# Altium project ATRACK_KP_V1.PrjPcb
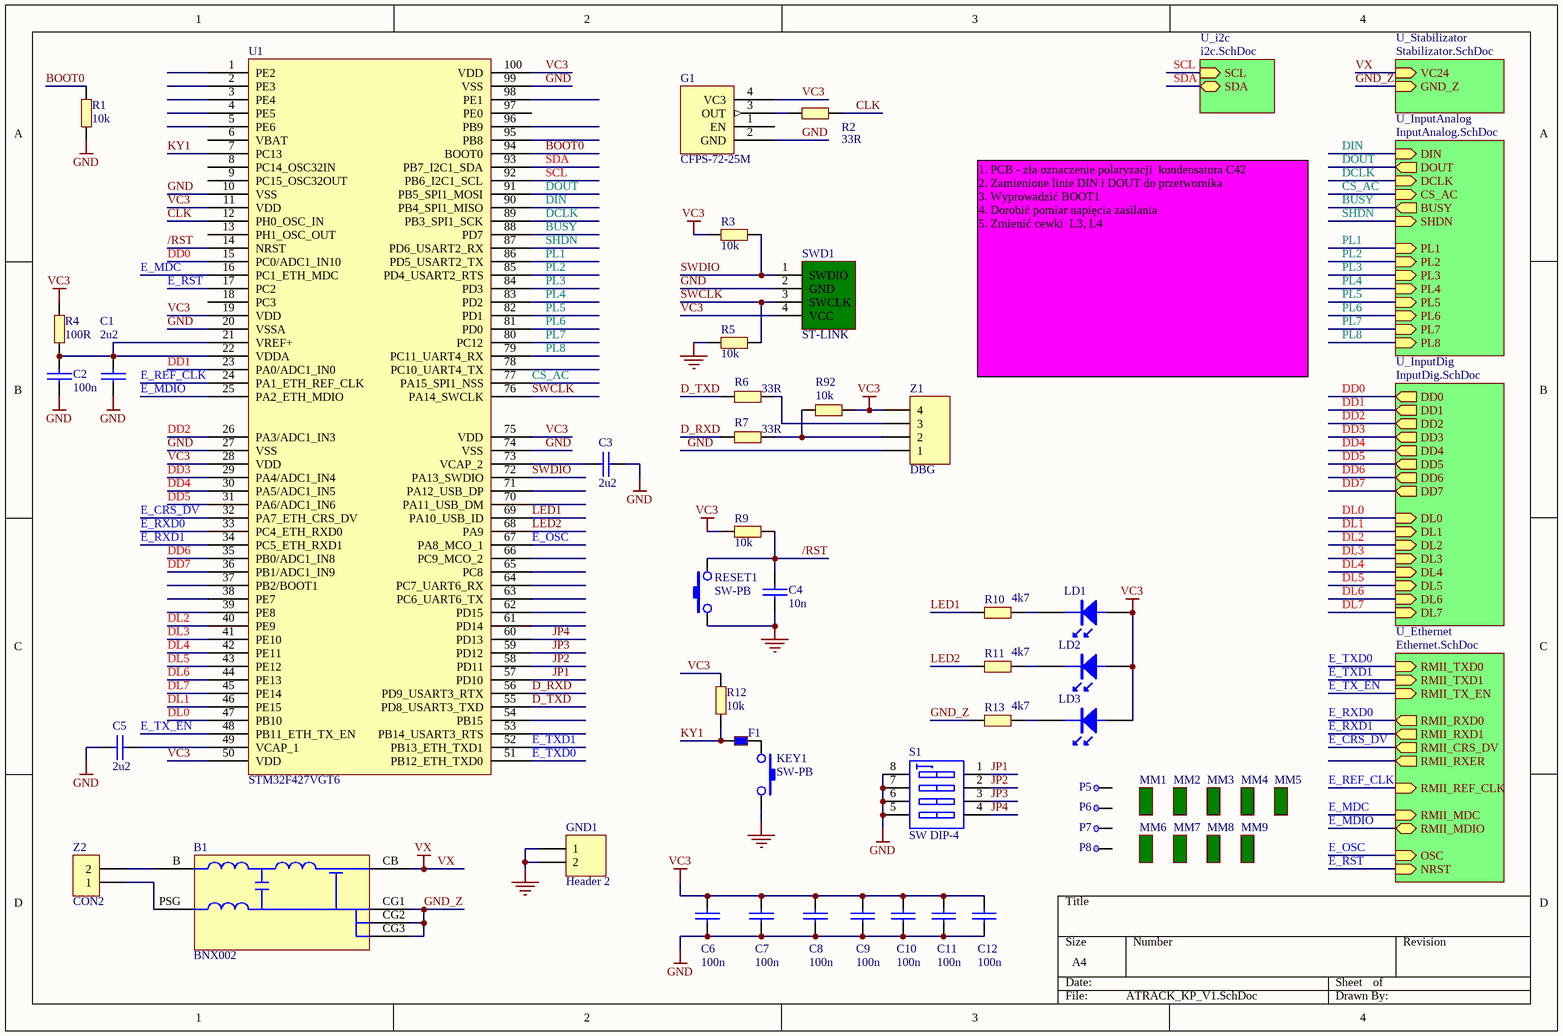
[diagram p0: ATRACK_KP_V1.SchDoc]
6 sheets, 246 parts. Net scope: hierarchical (ports join the sheet entries above them; power ports are global).
Board file: ATRACK_KP_V1.PcbDoc
Sheets:
  ATRACK_KP_V1.SchDoc
    U_Stabilizator = Stabilizator.SchDoc
    U_Ethernet = Ethernet.SchDoc
    U_InputDig = InputDig.SchDoc
    U_InputAnalog = InputAnalog.SchDoc
    U_i2c = i2c.SchDoc

## Sheet ATRACK_KP_V1.SchDoc
size A4

### Parts
B1  BNX002  [BNX002]
C1  2u2  [0603C]
C2  100n  [0603C]
C3  2u2  [0603C]
C4  10n  [0603C]
C5  2u2  [0603C]
C6  100n  [0603C]
C7  100n  [0603C]
C8  100n  [0603C]
C9  100n  [0603C]
C10  100n  [0603C]
C11  100n  [0603C]
C12  100n  [0603C]
F1  BLM18BB141SN1D  [0603L]  (value not drawn)
G1  CFPS-72-25M  [GEN_SMD1_1]
GND1  Header 2  [HDR1X2]
KEY1  SW-PB  [DTSM31N_2]
LD1  (no value)  [0603DG]
LD2  (no value)  [0603DR]
LD3  (no value)  [0603DG]
MM1  (no value)  [REF_CIR]
MM2  (no value)  [REF_CIR]
MM3  (no value)  [REF_SQR]
MM4  (no value)  [REF_SQR]
MM5  (no value)  [PB_FREE_GRAF]
MM6  (no value)  [REF_CIR]
MM7  (no value)  [REF_CIR]
MM8  (no value)  [REF_SQR]
MM9  (no value)  [REF_SQR]
P5  PP  [PP_SR]  (value not drawn)
P6  PP  [PP_SR]  (value not drawn)
P7  PP  [PP_SR]  (value not drawn)
P8  PP  [PP_SR]  (value not drawn)
R1  10k  [0603R]
R2  33R  [0603R]
R3  10k  [0603R]
R4  100R  [0603R]
R5  10k  [0603R]
R6  33R  [0603R]
R7  33R  [0603R]
R9  10k  [0603R]
R10  4k7  [0603R]
R11  4k7  [0603R]
R12  10k  [0603R]
R13  4k7  [0603R]
R92  10k  [0603R]
RESET1  SW-PB  [DTSM31N_2]
S1  SW DIP-4  [DIP8-SW]
SWD1  ST-LINK  [PIN4]
U1  STM32F427VGT6  [VQ100_2]
Z1  DBG  [PIN4]
Z2  CON2  [ARC-2-5.08-A1]

### Sub-sheets
U_Ethernet = Ethernet.SchDoc: RMII_TXD0 (in), RMII_TX_EN (in), RMII_RXD0 (out), RMII_REF_CLK (in), RMII_CRS_DV (out), RMII_MDC (in), RMII_MDIO (bidir), NRST (in), RMII_TXD1 (in), RMII_RXD1 (out), RMII_RXER (out), OSC (in)
U_i2c = i2c.SchDoc: SCL (in), SDA (bidir)
U_InputAnalog = InputAnalog.SchDoc: PL1 (in), PL2 (in), PL3 (in), PL4 (in), PL5 (in), PL6 (in), PL7 (in), DIN (in), DOUT (out), CS_AC (in), DCLK (in), BUSY (out), SHDN (in), PL8 (in)
U_InputDig = InputDig.SchDoc: DL0 (in), DL1 (in), DL2 (in), DL3 (in), DL4 (in), DL5 (in), DL6 (in), DL7 (in), DD0 (out), DD1 (out), DD2 (out), DD3 (out), DD4 (out), DD5 (out), DD6 (out), DD7 (out)
U_Stabilizator = Stabilizator.SchDoc: VC24 (in), GND_Z (in)

### Nets
GND: C1.2 C2.2 C3.1 C4.2 C5.1 C6.2 C7.2 C8.2 C9.2 C10.2 C11.2 C12.2 G1.2(GND) GND1.1 GND1.2 KEY1.2 R1.2 R5.1 RESET1.1 S1.5(B4) S1.6(B3) S1.7(B2) S1.8(B1) SWD1.2(GND) U1.10(VSS) U1.20(VSSA) U1.27(VSS) U1.74(VSS) U1.99(VSS) Z1.1
VC3: C6.1 C7.1 C8.1 C9.1 C10.1 C11.1 C12.1 G1.4(VC3) LD1.A LD2.A LD3.A R3.1 R4.2 R9.1 R12.2 R92.2 SWD1.4(VCC) U1.11(VDD) U1.19(VDD) U1.28(VDD) U1.50(VDD) U1.75(VDD) U1.100(VDD) Z1.4
VX: B1.CB ; sheet U_Stabilizator/VC24
/RST: C4.1 R9.2 RESET1.2 U1.14(NRST)
BOOT0: R1.1 U1.94(BOOT0)
BUSY: U1.88(PD7) ; sheet U_InputAnalog/BUSY
CLK: R2.2 U1.12(PH0_OSC_IN)
CS_AC: U1.77(PA15_SPI1_NSS) ; sheet U_InputAnalog/CS_AC  [project net /CS_AC]
D_RXD: R7.2 U1.56(PD9_USART3_RTX)
D_TXD: R6.2 U1.55(PD8_USART3_TXD)
DCLK: U1.89(PB3_SPI1_SCK) ; sheet U_InputAnalog/DCLK
DD0: U1.15(PC0/ADC1_IN10) ; sheet U_InputDig/DD0
DD1: U1.23(PA0/ADC1_IN0) ; sheet U_InputDig/DD1
DD2: U1.26(PA3/ADC1_IN3) ; sheet U_InputDig/DD2
DD3: U1.29(PA4/ADC1_IN4) ; sheet U_InputDig/DD3
DD4: U1.30(PA5/ADC1_IN5) ; sheet U_InputDig/DD4
DD5: U1.31(PA6/ADC1_IN6) ; sheet U_InputDig/DD5
DD6: U1.35(PB0/ADC1_IN8) ; sheet U_InputDig/DD6
DD7: U1.36(PB1/ADC1_IN9) ; sheet U_InputDig/DD7
DIN: U1.90(PB4_SPI1_MISO) ; sheet U_InputAnalog/DIN
DL0: U1.47(PB10) ; sheet U_InputDig/DL0
DL1: U1.46(PE15) ; sheet U_InputDig/DL1
DL2: U1.40(PE9) ; sheet U_InputDig/DL2
DL3: U1.41(PE10) ; sheet U_InputDig/DL3
DL4: U1.42(PE11) ; sheet U_InputDig/DL4
DL5: U1.43(PE12) ; sheet U_InputDig/DL5
DL6: U1.44(PE13) ; sheet U_InputDig/DL6
DL7: U1.45(PE14) ; sheet U_InputDig/DL7
DOUT: U1.91(PB5_SPI1_MOSI) ; sheet U_InputAnalog/DOUT
E_CRS_DV: U1.32(PA7_ETH_CRS_DV) ; sheet U_Ethernet/RMII_CRS_DV
E_MDC: U1.16(PC1_ETH_MDC) ; sheet U_Ethernet/RMII_MDC
E_MDIO: U1.25(PA2_ETH_MDIO) ; sheet U_Ethernet/RMII_MDIO
E_OSC: U1.67(PA8_MCO_1) ; sheet U_Ethernet/OSC
E_REF_CLK: U1.24(PA1_ETH_REF_CLK) ; sheet U_Ethernet/RMII_REF_CLK
E_RST: U1.17(PC2) ; sheet U_Ethernet/NRST
E_RXD0: U1.33(PC4_ETH_RXD0) ; sheet U_Ethernet/RMII_RXD0
E_RXD1: U1.34(PC5_ETH_RXD1) ; sheet U_Ethernet/RMII_RXD1
E_TX_EN: U1.48(PB11_ETH_TX_EN) ; sheet U_Ethernet/RMII_TX_EN
E_TXD0: U1.51(PB12_ETH_TXD0) ; sheet U_Ethernet/RMII_TXD0
E_TXD1: U1.52(PB13_ETH_TXD1) ; sheet U_Ethernet/RMII_TXD1
GND_Z: B1.CG1 B1.CG2 B1.CG3 R13.2 ; sheet U_Stabilizator/GND_Z
JP1: S1.1(A1) U1.57(PD10)
JP2: S1.2(A2) U1.58(PD11)
JP3: S1.3(A3) U1.59(PD12)
JP4: S1.4(A4) U1.60(PD13)
KY1: F1.2 R12.1 U1.7(PC13)
LED1: R10.2 U1.69(PA10_USB_ID)
LED2: R11.2 U1.68(PA9)
PL1: U1.86(PD5_USART2_TX) ; sheet U_InputAnalog/PL1
PL2: U1.85(PD4_USART2_RTS) ; sheet U_InputAnalog/PL2
PL3: U1.84(PD3) ; sheet U_InputAnalog/PL3
PL4: U1.83(PD2) ; sheet U_InputAnalog/PL4
PL5: U1.82(PD1) ; sheet U_InputAnalog/PL5
PL6: U1.81(PD0) ; sheet U_InputAnalog/PL6
PL7: U1.80(PC12) ; sheet U_InputAnalog/PL7
PL8: U1.79(PC11_UART4_RX) ; sheet U_InputAnalog/PL8
SCL: U1.92(PB6_I2C1_SCL) ; sheet U_i2c/SCL
SDA: U1.93(PB7_I2C1_SDA) ; sheet U_i2c/SDA
SHDN: U1.87(PD6_USART2_RX) ; sheet U_InputAnalog/SHDN
SWCLK: R5.2 SWD1.3(SWCLK) U1.76(PA14_SWCLK)
SWDIO: R3.2 SWD1.1(SWDIO) U1.72(PA13_SWDIO)
NetB1_B: B1.B Z2.2
NetB1_PSG: B1.PSG Z2.1
NetC1_1: C1.1 C2.1 R4.1 U1.21(VREF+) U1.22(VDDA)
NetC3_2: C3.2 U1.73(VCAP_2)
NetC5_2: C5.2 U1.49(VCAP_1)
NetF1_1: F1.1 KEY1.1
NetG1_3: G1.3(OUT) R2.1
NetLD1_K: LD1.K R10.1
NetLD2_K: LD2.K R11.1
NetLD3_K: LD3.K R13.1
NetR6_1: R6.1 Z1.3
NetR7_1: R7.1 R92.1 Z1.2

Not connected (* = marked no-connect by the designer): G1 1(EN); P5 1; P6 1; P7 1; P8 1; U1 1(PE2) 2(PE3) 3(PE4) 4(PE5) 5(PE6) 6(VBAT) 8(PC14_OSC32IN) 9(PC15_OSC32OUT) 13(PH1_OSC_OUT) 18(PC3) 37(PB2/BOOT1) 38(PE7) 39(PE8) 53(PB14_USART3_RTS) 54(PB15) 61(PD14) 62(PD15) 63(PC6_UART6_TX) 64(PC7_UART6_RX) 65(PC8) 66(PC9_MCO_2) 70(PA11_USB_DM) 71(PA12_USB_DP) 78(PC10_UART4_TX) 95(PB8) 96(PB9) 97(PE0) 98(PE1)

### Notes on the sheet
- 1. PCB - zła oznaczenie polaryzacji  kondensatora C42
  2. Zamienione linie DIN i DOUT do przetwornika
  3. Wyprowadzić BOOT1
  4. Dorobić pomiar napięcia zasilania
  5. Zmienić cewki  L3, L4

### Library data of the parts
C1-C12 = CAP: Capacitor
F1 = KORALIK: Koralik ferrytowy
G1 = GENER_SMD
GND1 = Header 2: Header, 2-Pin; LatestRevisionDate: 17-Jul-2002; LatestRevisionNote: Re-released for DXP Platform.; Publisher: Altium Limited
LD1-LD3 = LED
MM1-MM9 = MECH
R1-R7 R9-R13 R92 = RES3
S1 = SW DIP-4: DIP Switch
SWD1 = SW_CON: Header, 4-Pin; LatestRevisionDate: 17-Jul-2002; LatestRevisionNote: Re-released for DXP Platform.; Publisher: Altium Limited
U1 = STM32F427_LQFP100
Z1 = Header 4: Header, 4-Pin; LatestRevisionDate: 17-Jul-2002; LatestRevisionNote: Re-released for DXP Platform.; Publisher: Altium Limited
Z2 = CON2: Connector

## Sheet Stabilizator.SchDoc
size A4
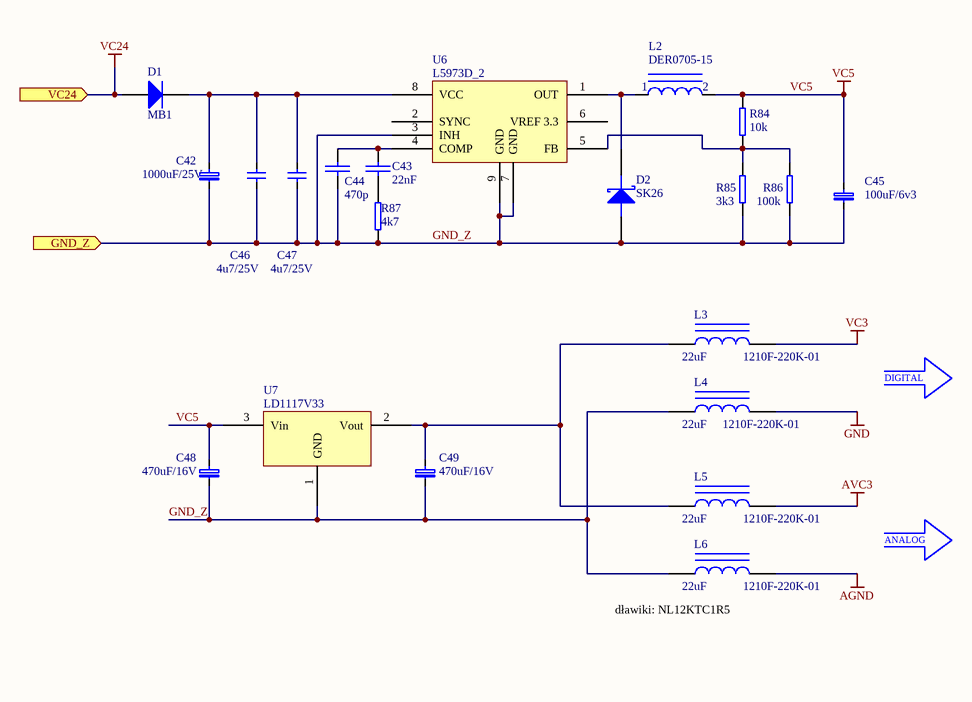
[diagram p1: Stabilizator.SchDoc]

### Parts
C42  1000uF/25V  [RB-.2/.4]
C43  22nF  [0603C]
C44  470p  [0603C]
C45  100uF/6v3  [CAP_C]
C46  4u7/25V  [1206]
C47  4u7/25V  [1206]
C48  470uF/16V  [CAP_D]
C49  470uF/16V  [CAP_D]
D1  MB1  [RD5]
D2  SK26  [RD5]
L2  DER0705-15  [DER0705_1]
L3  1210F-220K-01  value 22uF  [IND_1812]
L4  1210F-220K-01  value 22uF  [IND_1812]
L5  1210F-220K-01  value 22uF  [IND_1812]
L6  1210F-220K-01  value 22uF  [IND_1812]
R84  10k  [0603R]
R85  3k3  [0603R]
R86  100k  [0603R]
R87  4k7  [0603R]
U6  L5973D_2  [SO8_M]
U7  LD1117V33  [DPAK]

### Ports
GND_Z (in), VC24 (in)

### Nets
AGND: L6.2
AVC3: L5.2
GND: L4.2
VC3: L3.2
VC5: C45.2 C48.2 L2.2 R84.1 U7.3(Vin)
VC24: D1.A ; port VC24  [project net VX]
GND_Z: C42.1 C44.2 C45.1 C46.1 C47.1 C48.1 C49.1 D2.A L4.1 L6.1 R85.2 R86.2 R87.2 U6.3(INH) U6.7(GND) U6.9(GND) U7.1(GND) ; port GND_Z
NetC42_2: C42.2 C46.2 C47.2 D1.K U6.8(VCC)
NetC43_1: C43.1 R87.1
NetC43_2: C43.2 C44.1 U6.4(COMP)
NetC49_2: C49.2 L3.1 L5.1 U7.2(Vout)
NetD2_K: D2.K L2.1 U6.1(OUT)
NetR84_2: R84.2 R85.1 R86.1 U6.5(FB)

Not connected (* = marked no-connect by the designer): U6 2(SYNC) 6(VREF_3.3)

### Notes on the sheet
- DIGITAL
- ANALOG
- (near L6) dławiki: NL12KTC1R5

### Library data of the parts
C42 C45 C48 C49 = CAP_TANTAL_SMD: KONDENSATOR ELEKTROLITYCZNY TANTALOWY SMD
C43 C44 = CAP: Capacitor
C46 C47 = CAP
D1 = Diode: Default Diode; Published: 8-Jun-2000; LatestRevisionDate: 17-Jul-2002; LatestRevisionNote: Re-released for DXP Platform.; PackageVersion: Sep-1996; PackageReference: SMC; Publisher: Altium Limited; PackageDescription: DO-214-AB/SMC; 2 C-Bend Leads; Body 7.9 x 5.9 mm, inc. leads (LxW); Code_JEDEC: DO-214-AB
D2 = DIODE SCHOTTKY: Schottky Diode
L2 = CEWKA_1
L3-L6 = Inductor Iron: Magnetic-Core Inductor; Dostawca.Symbol: DL1210-0.47; Dostawca: TME; Published: 24-Mar-1999; LatestRevisionDate: 17-Jul-2002; LatestRevisionNote: Re-released for DXP Platform.; PackageReference: AXIAL-0.9; Publisher: Altium Limited
R84-R87 = RES3

## Sheet Ethernet.SchDoc
size A4
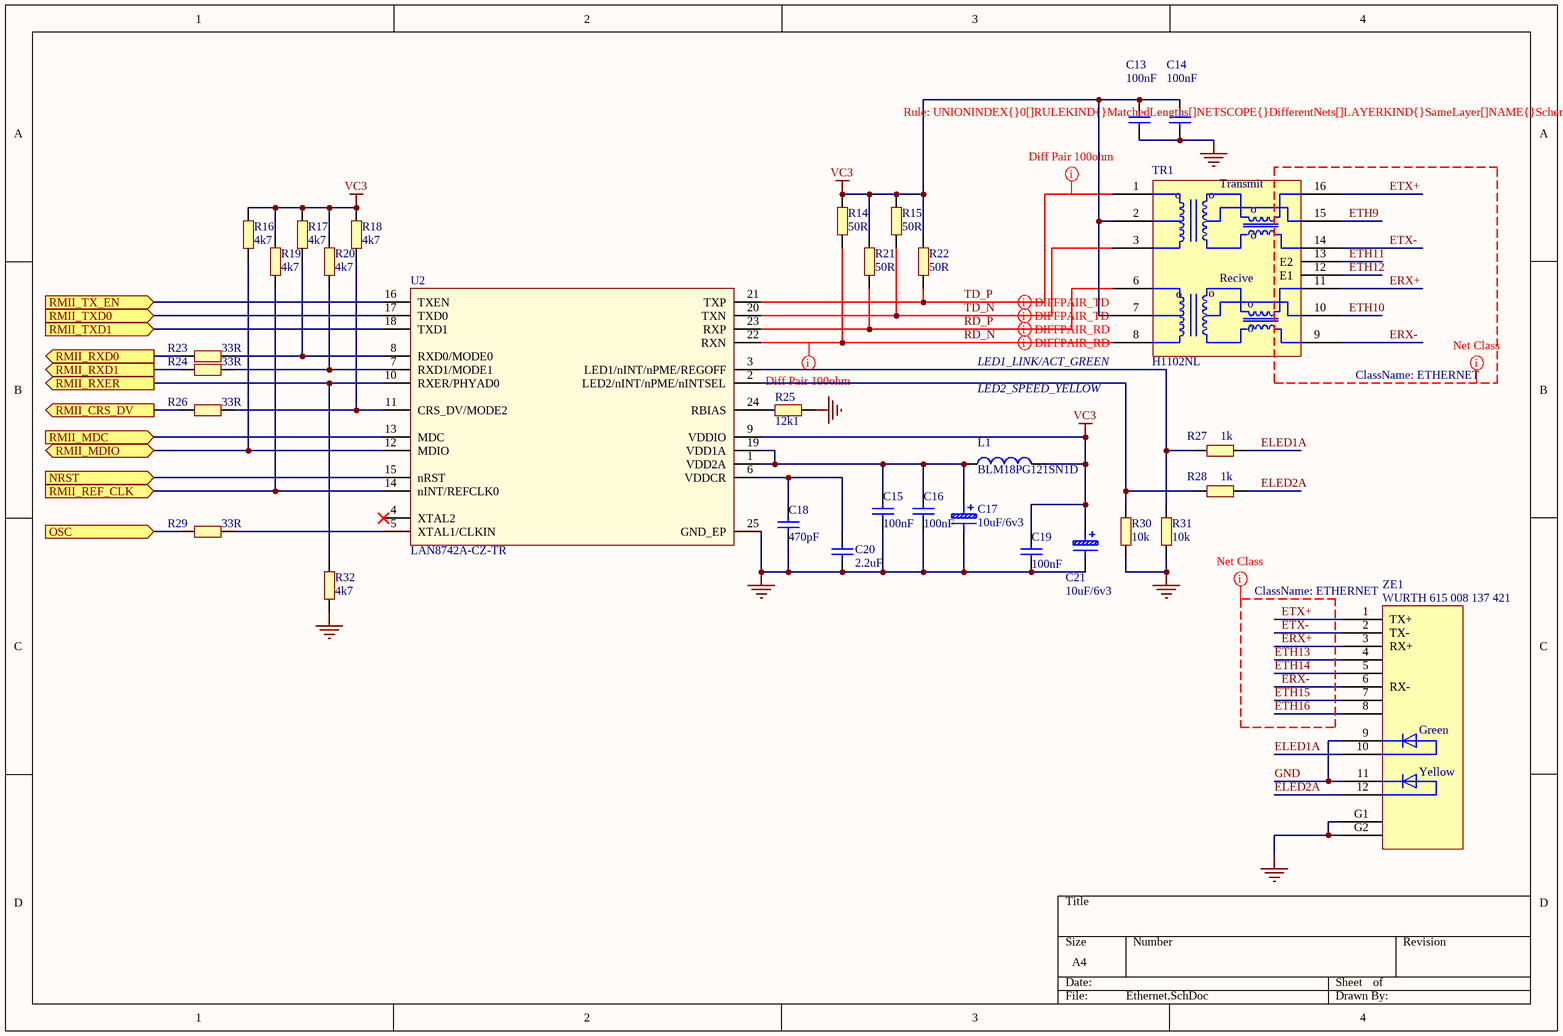
[diagram p2: Ethernet.SchDoc]

### Parts
C13  100nF  [0603C]
C14  100nF  [0603C]
C15  100nF  [0603C]
C16  100nF  [0603C]
C17  10uF/6v3  [CAP_A]
C18  470pF  [0603C]
C19  100nF  [0603C]
C20  2.2uF  [0603C]
C21  10uF/6v3  [CAP_A]
L1  BLM18PG121SN1D  [0603L]
R14  50R  [0603R]
R15  50R  [0603R]
R16  4k7  [0603R]
R17  4k7  [0603R]
R18  4k7  [0603R]
R19  4k7  [0603R]
R20  4k7  [0603R]
R21  50R  [0603R]
R22  50R  [0603R]
R23  33R  [0603R]
R24  33R  [0603R]
R25  12k1  [0603R]
R26  33R  [0603R]
R27  1k  [0603R]
R28  1k  [0603R]
R29  33R  [0603R]
R30  10k  [0603R]
R31  10k  [0603R]
R32  4k7  [0603R]
TR1  H1102NL  [H1102]
U2  LAN8742A-CZ-TR  [QFN24_LAN]
ZE1  WURTH 615 008 137 421  [RJHSE-3381]

### Ports
NRST (in), OSC (in), RMII_CRS_DV (out), RMII_MDC (in), RMII_MDIO (bidir), RMII_REF_CLK (in), RMII_RXD0 (out), RMII_RXD1 (out), RMII_RXER (out), RMII_TX_EN (in), RMII_TXD0 (in), RMII_TXD1 (in)

### Nets
GND: C13.1 C14.1 C15.1 C16.1 C17.1 C18.1 C19.1 C20.1 C21.1 R25.1 R30.1 R31.1 R32.1 U2.25(GND_EP) ZE1.9 ZE1.11 ZE1.G1 ZE1.G2
VC3: C13.2 C14.2 C19.2 C21.2 L1.2 R14.2 R15.2 R16.2 R17.1 R18.1 R19.2 R20.1 R21.2 R22.2 TR1.2(TI2) TR1.7(RI2) U2.9(VDDIO)
E_CRS_DV: R26.1 ; port RMII_CRS_DV
E_MDC: U2.13(MDC) ; port RMII_MDC
E_MDIO: R16.1 U2.12(MDIO) ; port RMII_MDIO
E_OSC: R29.1 ; port OSC
E_REF_CLK: R19.1 U2.14(nINT/REFCLK0) ; port RMII_REF_CLK
E_RST: U2.15(nRST) ; port NRST
E_RXD0: R23.1 ; port RMII_RXD0
E_RXD1: R24.1 ; port RMII_RXD1
E_TX_EN: U2.16(TXEN) ; port RMII_TX_EN
E_TXD0: U2.17(TXD0) ; port RMII_TXD0
E_TXD1: U2.18(TXD1) ; port RMII_TXD1
ELED1A: R27.1 ZE1.10
ELED2A: R28.1 ZE1.12
ERX+: TR1.11(RO1) ZE1.3(RX+)
ERX-: TR1.9(RO2) ZE1.6(RX-)
ETH9: TR1.15
ETH10: TR1.10
ETH11: TR1.13(E2)
ETH12: TR1.12(E1)
ETH13: ZE1.4
ETH14: ZE1.5
ETH15: ZE1.7
ETH16: ZE1.8
ETX+: TR1.16(TO1) ZE1.1(TX+)
ETX-: TR1.14(TO2) ZE1.2(TX-)
RD_N: R14.1 TR1.8(RI3) U2.22(RXN)
RD_P: R21.1 TR1.6(RI1) U2.23(RXP)
TD_N: R15.1 TR1.3(TI3) U2.20(TXN)
TD_P: R22.1 TR1.1(TI1) U2.21(TXP)
NetC15_2: C15.2 C16.2 C17.2 L1.1 U2.1(VDD2A) U2.19(VDD1A)
NetC18_2: C18.2 C20.2 U2.6(VDDCR)
NetR17_2: R17.2 R23.2 U2.8(RXD0/MODE0)
NetR18_2: R18.2 R26.2 U2.11(CRS_DV/MODE2)
NetR20_2: R20.2 R24.2 U2.7(RXD1/MODE1)
NetR25_2: R25.2 U2.24(RBIAS)
NetR27_2: R27.2 R31.2 U2.3(LED1/nINT/nPME/REGOFF)
NetR28_2: R28.2 R30.2 U2.2(LED2/nINT/nPME/nINTSEL)
NetR29_2: R29.2 U2.5(XTAL1/CLKIN)
NetR32_2: R32.2 U2.10(RXER/PHYAD0) ; port RMII_RXER

Not connected (* = marked no-connect by the designer): U2 4(XTAL2)*

### Layout directives
differential pair: RD_N, RD_P, TD_N, TD_P
rule Matched Net Lengths [Tolerance = 300mil]: RD_N, TD_P
net class ETHERNET: ERX+, ERX-, ETH9, ETH10, ETH11, ETH12, ETH13, ETH14, ETH15, ETH16, ETX+, ETX-

### Notes on the sheet
- LED1_LINK/ACT_GREEN
- LED2_SPEED_YELLOW
- (in symbol H1102NL) Transmit; o; Recive
- (in symbol RJ45GELED) Green; Yellow

### Library data of the parts
C13-C16 C19 = Cap_100nF_X7R_10%_0402: Capacitor,100nF,16V,X7R,10%,0402,YAGEO; Manuf_Part_1: CC0402KRX7R7BB104; Revision: July-2002: Re-released for DXP Platform.; Value: 100nF; Order: CC0402KRX7R7BB104; Manuf_1: YAGEO
C17 C21 = CapTantal
C18 = Cap_470pF_X7R_10%_0402: Capacitor,470pF,16V,X7R,10%,0402,YAGEO; Manuf_Part_1: 0402YC471KAT4A; Revision: July-2002: Re-released for DXP Platform.; Value: 470pF; Order: 0402YC471KAT4A; Manuf_1: YAGEO; ECCN_US/EU: n/a
C20 = Cap_1uF_X5R_10%_0603: Capacitor,1uF,16V,X5R,10%,0603,YAGEO; Manuf_Part_1: CC0603KRX5R7BB105; Revision: July-2002: Re-released for DXP Platform.; Value: 1uF; Order: CC0603KRX5R7BB105; Manuf_1: YAGEO; ECCN_US/EU: n/a
L1 = BEAD_120R_2A_0603: Bead,120R,2A,0603,BLM18PG121SN1D,MURATA; Manuf_Part_3: FCM1608KF-601T03; Manuf_2: TDK; Manuf_Part_2: MPZ1608S300A; Manuf_3: Tai-tech; Value: 100uH; Description_3: Bead,600R,350mA,0603,FCM1608KF-601T03,Tai-tech; Description_2: Bead,30R,5A,0603,MPZ1608S300A,TDK; Revision: July-2002: Re-released for DXP Platform.; ECCN_US/EU: n/a; Manuf_Part_1: BLM18PG121SN1D; Manuf_1: MURATA
R14-R32 = RES3
TR1 = H1102NL: Dostawca.Symbol: 749010310; Dostawca: WURTH
U2 = LAN8742A-CZ-TR: LAN8742A-CZ-TR - Small Footprint RMII 10/100 Ethernet, Transceiver with HP Auto-MDIX and flexPWR Technology SQFN-24; Manuf_1: MICROCHIP; Dostawca.Symbol: 579-LAN8742A-CZ; Dostawca: Mouser; Order: LAN8742A-CZ-TR; Manuf_Part_1: LAN8742A-CZ-TR; Distrib: MICROCHIP
ZE1 = RJ45GELED

## Sheet InputDig.SchDoc
size A4 portrait
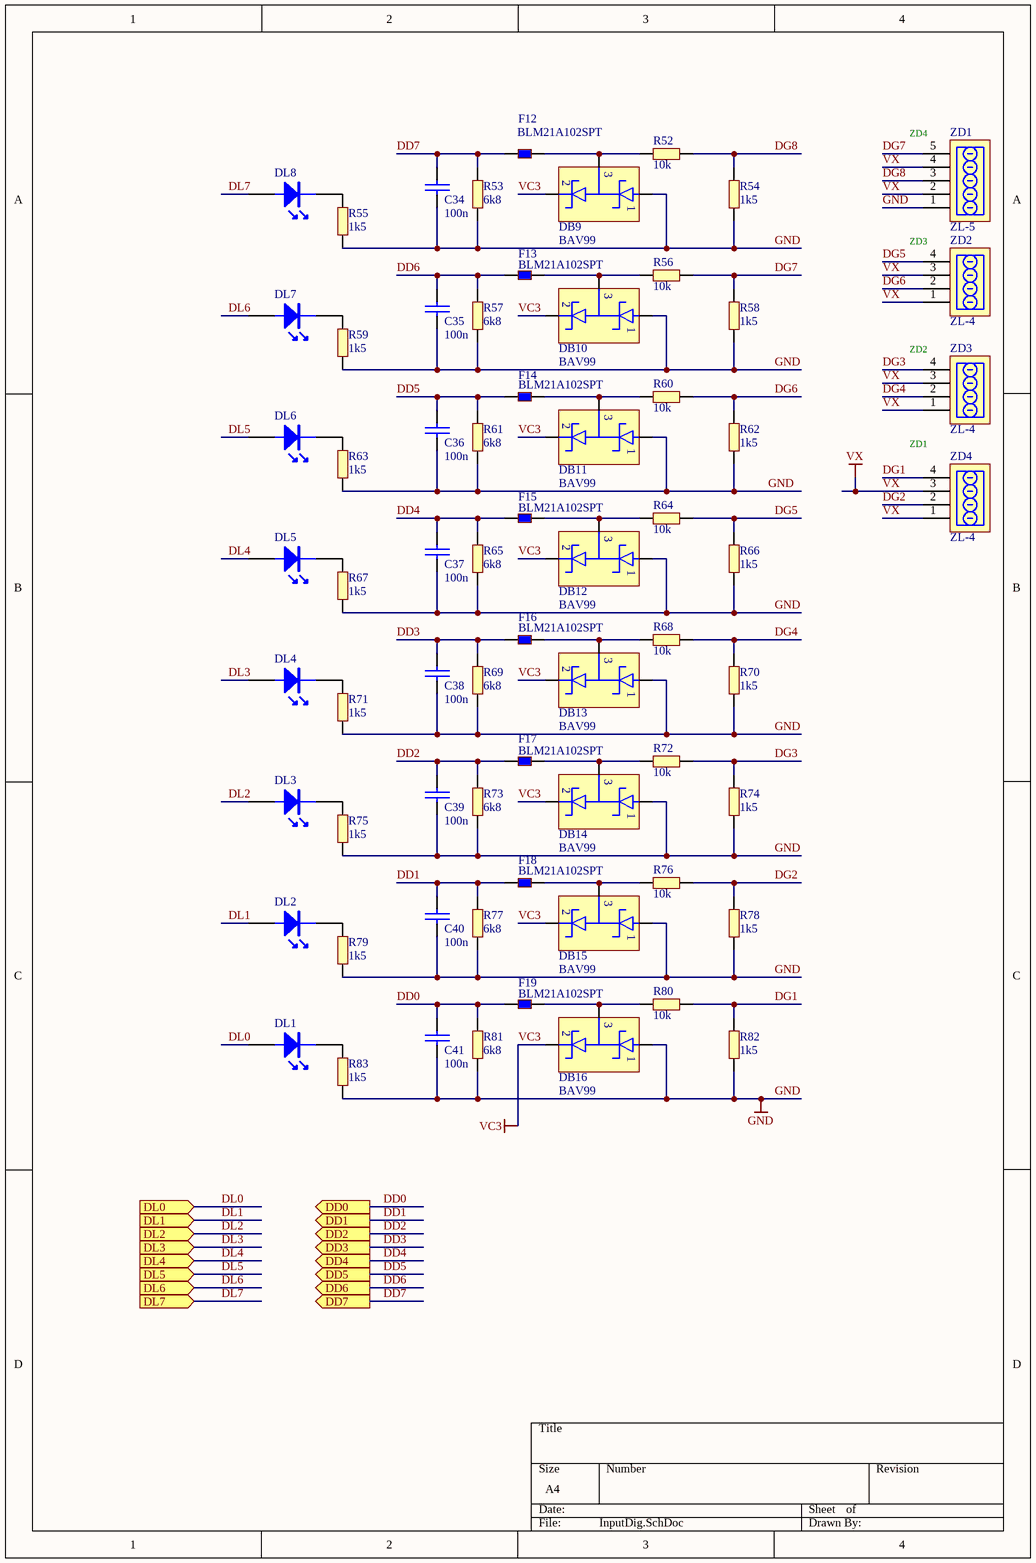
[diagram p3: InputDig.SchDoc]

### Parts
C34  100n  [0603C]
C35  100n  [0603C]
C36  100n  [0603C]
C37  100n  [0603C]
C38  100n  [0603C]
C39  100n  [0603C]
C40  100n  [0603C]
C41  100n  [0603C]
DB9  BAV99  [SOT-23]
DB10  BAV99  [SOT-23]
DB11  BAV99  [SOT-23]
DB12  BAV99  [SOT-23]
DB13  BAV99  [SOT-23]
DB14  BAV99  [SOT-23]
DB15  BAV99  [SOT-23]
DB16  BAV99  [SOT-23]
DL1  (no value)  [0603DR]
DL2  (no value)  [0603DR]
DL3  (no value)  [0603DR]
DL4  (no value)  [0603DR]
DL5  (no value)  [0603DR]
DL6  (no value)  [0603DR]
DL7  (no value)  [0603DR]
DL8  (no value)  [0603DR]
F12  BLM21A102SPT  [0603L]
F13  BLM21A102SPT  [0603L]
F14  BLM21A102SPT  [0603L]
F15  BLM21A102SPT  [0603L]
F16  BLM21A102SPT  [0603L]
F17  BLM21A102SPT  [0603L]
F18  BLM21A102SPT  [0603L]
F19  BLM21A102SPT  [0603L]
R52  10k  [0603R]
R53  6k8  [0603R]
R54  1k5  [0805R]
R55  1k5  [0603R]
R56  10k  [0603R]
R57  6k8  [0603R]
R58  1k5  [0805R]
R59  1k5  [0603R]
R60  10k  [0603R]
R61  6k8  [0603R]
R62  1k5  [0805R]
R63  1k5  [0603R]
R64  10k  [0603R]
R65  6k8  [0603R]
R66  1k5  [0805R]
R67  1k5  [0603R]
R68  10k  [0603R]
R69  6k8  [0603R]
R70  1k5  [0805R]
R71  1k5  [0603R]
R72  10k  [0603R]
R73  6k8  [0603R]
R74  1k5  [0805R]
R75  1k5  [0603R]
R76  10k  [0603R]
R77  6k8  [0603R]
R78  1k5  [0805R]
R79  1k5  [0603R]
R80  10k  [0603R]
R81  6k8  [0603R]
R82  1k5  [0805R]
R83  1k5  [0603R]
ZD1  ZL-5  [ARC-5-3.5-TYCO-2]
ZD2  ZL-4  [ARC-4-3.5-TYCO-2]
ZD3  ZL-4  [ARC-4-3.5-TYCO-2]
ZD4  ZL-4  [ARC-4-3.5-TYCO-2]

### Ports
DD0 (out), DD1 (out), DD2 (out), DD3 (out), DD4 (out), DD5 (out), DD6 (out), DD7 (out), DL0 (in), DL1 (in), DL2 (in), DL3 (in), DL4 (in), DL5 (in), DL6 (in), DL7 (in)

### Nets
GND: C34.2 C35.2 C36.2 C37.2 C38.2 C39.2 C40.2 C41.2 DB9.1 DB10.1 DB11.1 DB12.1 DB13.1 DB14.1 DB15.1 DB16.1 R53.2 R54.2 R55.2 R57.2 R58.2 R59.2 R61.2 R62.2 R63.2 R65.2 R66.2 R67.2 R69.2 R70.2 R71.2 R73.2 R74.2 R75.2 R77.2 R78.2 R79.2 R81.2 R82.2 R83.2 ZD1.1
VC3: DB9.2 DB10.2 DB11.2 DB12.2 DB13.2 DB14.2 DB15.2 DB16.2
VX: ZD1.2 ZD1.4 ZD2.1 ZD2.3 ZD3.1 ZD3.3 ZD4.1 ZD4.3
DD0: C41.1 F19.1 R81.1 ; port DD0
DD1: C40.1 F18.1 R77.1 ; port DD1
DD2: C39.1 F17.1 R73.1 ; port DD2
DD3: C38.1 F16.1 R69.1 ; port DD3
DD4: C37.1 F15.1 R65.1 ; port DD4
DD5: C36.1 F14.1 R61.1 ; port DD5
DD6: C35.1 F13.1 R57.1 ; port DD6
DD7: C34.1 F12.1 R53.1 ; port DD7
DG1: R80.1 R82.1 ZD4.4
DG2: R76.1 R78.1 ZD4.2
DG3: R72.1 R74.1 ZD3.4
DG4: R68.1 R70.1 ZD3.2
DG5: R64.1 R66.1 ZD2.4
DG6: R60.1 R62.1 ZD2.2
DG7: R56.1 R58.1 ZD1.5
DG8: R52.1 R54.1 ZD1.3
DL0: DL1.A ; port DL0
DL1: DL2.A ; port DL1
DL2: DL3.A ; port DL2
DL3: DL4.A ; port DL3
DL4: DL5.A ; port DL4
DL5: DL6.A ; port DL5
DL6: DL7.A ; port DL6
DL7: DL8.A ; port DL7
NetDB9_3: DB9.3 F12.2 R52.2
NetDB10_3: DB10.3 F13.2 R56.2
NetDB11_3: DB11.3 F14.2 R60.2
NetDB12_3: DB12.3 F15.2 R64.2
NetDB13_3: DB13.3 F16.2 R68.2
NetDB14_3: DB14.3 F17.2 R72.2
NetDB15_3: DB15.3 F18.2 R76.2
NetDB16_3: DB16.3 F19.2 R80.2
NetDL1_K: DL1.K R83.1
NetDL2_K: DL2.K R79.1
NetDL3_K: DL3.K R75.1
NetDL4_K: DL4.K R71.1
NetDL5_K: DL5.K R67.1
NetDL6_K: DL6.K R63.1
NetDL7_K: DL7.K R59.1
NetDL8_K: DL8.K R55.1

### Notes on the sheet
- (near ZD1) ZD4
- ZD3
- (near ZD3) ZD2
- ZD1

### Library data of the parts
C34-C41 = CAP: Capacitor
DB9-DB16 = BAS70-04
DL1-DL8 = LED
F12-F19 = KORALIK: Koralik ferrytowy
R52-R83 = RES3

## Sheet InputAnalog.SchDoc
size A4
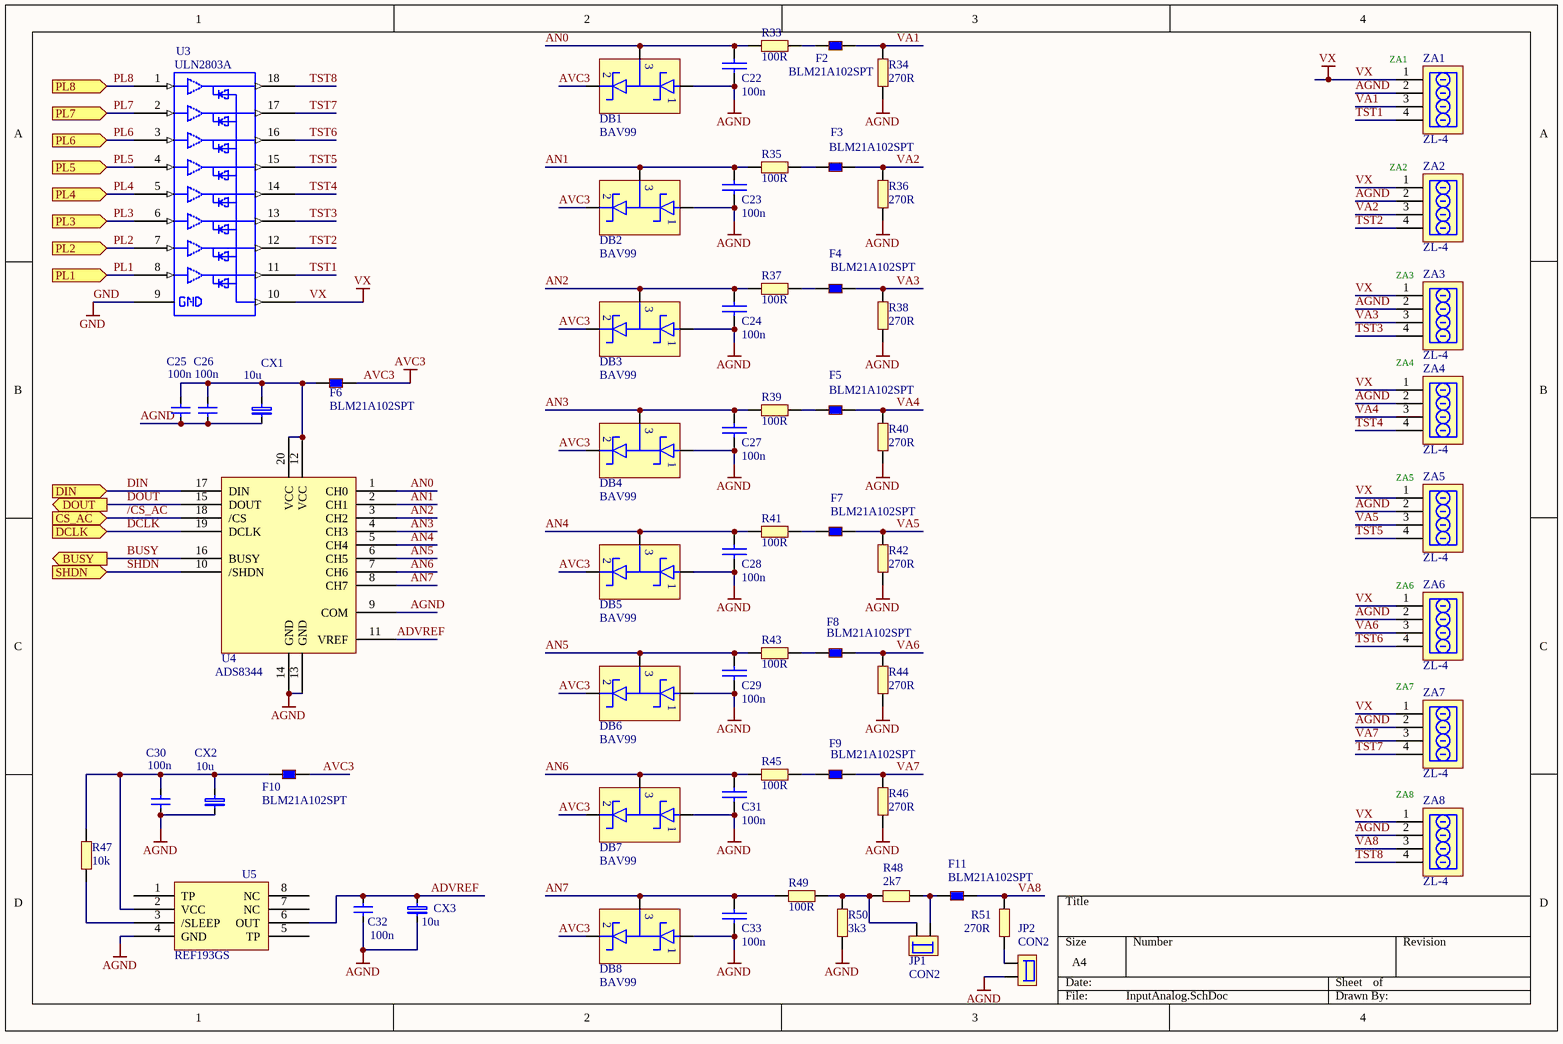
[diagram p4: InputAnalog.SchDoc]

### Parts
C22  100n  [0603C]
C23  100n  [0603C]
C24  100n  [0603C]
C25  100n  [0603C]
C26  100n  [0603C]
C27  100n  [0603C]
C28  100n  [0603C]
C29  100n  [0603C]
C30  100n  [0603C]
C31  100n  [0603C]
C32  100n  [0603C]
C33  100n  [0603C]
CX1  10u  [CAP_A]
CX2  10u  [CAP_A]
CX3  10u  [CAP_A]
DB1  BAV99  [SOT-23]
DB2  BAV99  [SOT-23]
DB3  BAV99  [SOT-23]
DB4  BAV99  [SOT-23]
DB5  BAV99  [SOT-23]
DB6  BAV99  [SOT-23]
DB7  BAV99  [SOT-23]
DB8  BAV99  [SOT-23]
F2  BLM21A102SPT  [0603L]
F3  BLM21A102SPT  [0603L]
F4  BLM21A102SPT  [0603L]
F5  BLM21A102SPT  [0603L]
F6  BLM21A102SPT  [0603L]
F7  BLM21A102SPT  [0603L]
F8  BLM21A102SPT  [0603L]
F9  BLM21A102SPT  [0603L]
F10  BLM21A102SPT  [0603L]
F11  BLM21A102SPT  [0603L]
JP1  CON2  [SIP2]
JP2  CON2  [SIP2]
R33  100R  [0603R]
R34  270R  [0805R]
R35  100R  [0603R]
R36  270R  [0805R]
R37  100R  [0603R]
R38  270R  [0805R]
R39  100R  [0603R]
R40  270R  [0805R]
R41  100R  [0603R]
R42  270R  [0805R]
R43  100R  [0603R]
R44  270R  [0805R]
R45  100R  [0603R]
R46  270R  [0805R]
R47  10k  [0603R]
R48  2k7  [0603R]
R49  100R  [0603R]
R50  3k3  [0603R]
R51  270R  [0805R]
U3  ULN2803A  [SO-18]
U4  ADS8344  [TSSOP20]
U5  REF193GS  [SO8]
ZA1  ZL-4  [ARC-4-3.5-TYCO-2]
ZA2  ZL-4  [ARC-4-3.5-TYCO-2]
ZA3  ZL-4  [ARC-4-3.5-TYCO-2]
ZA4  ZL-4  [ARC-4-3.5-TYCO-2]
ZA5  ZL-4  [ARC-4-3.5-TYCO-2]
ZA6  ZL-4  [ARC-4-3.5-TYCO-2]
ZA7  ZL-4  [ARC-4-3.5-TYCO-2]
ZA8  ZL-4  [ARC-4-3.5-TYCO-2]

### Ports
BUSY (out), CS_AC (in), DCLK (in), DIN (in), DOUT (out), PL1 (in), PL2 (in), PL3 (in), PL4 (in), PL5 (in), PL6 (in), PL7 (in), PL8 (in), SHDN (in)

### Nets
AGND: C22.2 C23.2 C24.2 C25.2 C26.2 C27.2 C28.2 C29.2 C30.2 C31.2 C32.2 C33.2 CX1.1 CX2.1 CX3.1 DB1.1 DB2.1 DB3.1 DB4.1 DB5.1 DB6.1 DB7.1 DB8.1 JP2.2 R34.1 R36.1 R38.1 R40.1 R42.1 R44.1 R46.1 R50.2 U4.9(COM) U4.13(GND) U4.14(GND) U5.4(GND) ZA1.2 ZA2.2 ZA3.2 ZA4.2 ZA5.2 ZA6.2 ZA7.2 ZA8.2
AVC3: DB1.2 DB2.2 DB3.2 DB4.2 DB5.2 DB6.2 DB7.2 DB8.2 F6.2 F10.2
GND: U3.9
VX: U3.10 ZA1.1 ZA2.1 ZA3.1 ZA4.1 ZA5.1 ZA6.1 ZA7.1 ZA8.1
/CS_AC: U4.18(/CS) ; port CS_AC
ADVREF: C32.1 CX3.2 U4.11(VREF) U5.6(OUT)
AN0: C22.1 DB1.3 R33.2 U4.1(CH0)
AN1: C23.1 DB2.3 R35.2 U4.2(CH1)
AN2: C24.1 DB3.3 R37.2 U4.3(CH2)
AN3: C27.1 DB4.3 R39.2 U4.4(CH3)
AN4: C28.1 DB5.3 R41.2 U4.5(CH4)
AN5: C29.1 DB6.3 R43.2 U4.6(CH5)
AN6: C31.1 DB7.3 R45.2 U4.7(CH6)
AN7: C33.1 DB8.3 R49.2 U4.8(CH7)
BUSY: U4.16(BUSY) ; port BUSY
DCLK: U4.19(DCLK) ; port DCLK
DIN: U4.17(DIN) ; port DIN
DOUT: U4.15(DOUT) ; port DOUT
PL1: U3.8 ; port PL1
PL2: U3.7 ; port PL2
PL3: U3.6 ; port PL3
PL4: U3.5 ; port PL4
PL5: U3.4 ; port PL5
PL6: U3.3 ; port PL6
PL7: U3.2 ; port PL7
PL8: U3.1 ; port PL8
SHDN: U4.10(/SHDN) ; port SHDN
TST1: U3.11 ZA1.4
TST2: U3.12 ZA2.4
TST3: U3.13 ZA3.4
TST4: U3.14 ZA4.4
TST5: U3.15 ZA5.4
TST6: U3.16 ZA6.4
TST7: U3.17 ZA7.4
TST8: U3.18 ZA8.4
VA1: F2.2 R34.2 ZA1.3
VA2: F3.2 R36.2 ZA2.3
VA3: F4.2 R38.2 ZA3.3
VA4: F5.2 R40.2 ZA4.3
VA5: F7.2 R42.2 ZA5.3
VA6: F8.2 R44.2 ZA6.3
VA7: F9.2 R46.2 ZA7.3
VA8: F11.2 R51.2 ZA8.3
NetC25_1: C25.1 C26.1 CX1.2 F6.1 U4.12(VCC) U4.20(VCC)
NetC30_1: C30.1 CX2.2 F10.1 R47.1 U5.2(VCC)
NetF2_1: F2.1 R33.1
NetF3_1: F3.1 R35.1
NetF4_1: F4.1 R37.1
NetF5_1: F5.1 R39.1
NetF7_1: F7.1 R41.1
NetF8_1: F8.1 R43.1
NetF9_1: F9.1 R45.1
NetF11_1: F11.1 JP1.1 R48.1
NetJP1_2: JP1.2 R48.2 R49.1 R50.1
NetJP2_1: JP2.1 R51.1
NetR47_2: R47.2 U5.3(/SLEEP)

Not connected (* = marked no-connect by the designer): U5 1(TP) 5(TP) 7(NC) 8(NC)

### Notes on the sheet
- (near ZA1) ZA1
- (near ZA2) ZA2
- (near ZA3) ZA3
- ZA4
- (near ZA5) ZA5
- (near ZA6) ZA6
- ZA7
- ZA8

### Library data of the parts
C22-C24 C27-C29 C31 C33 = CAP: Capacitor
C25 C26 C30 C32 = CAP
CX1-CX3 = CAP_TANTAL_SMD: as C42 on sheet Stabilizator
DB1-DB8 = BAS70-04
F2-F11 = KORALIK: Koralik ferrytowy
JP1 JP2 = JUMP2: Connector
R33-R51 = RES3
U3 = Pro31.tmp_ULN2803A_42
U5 = REF19X

## Sheet i2c.SchDoc
size A4
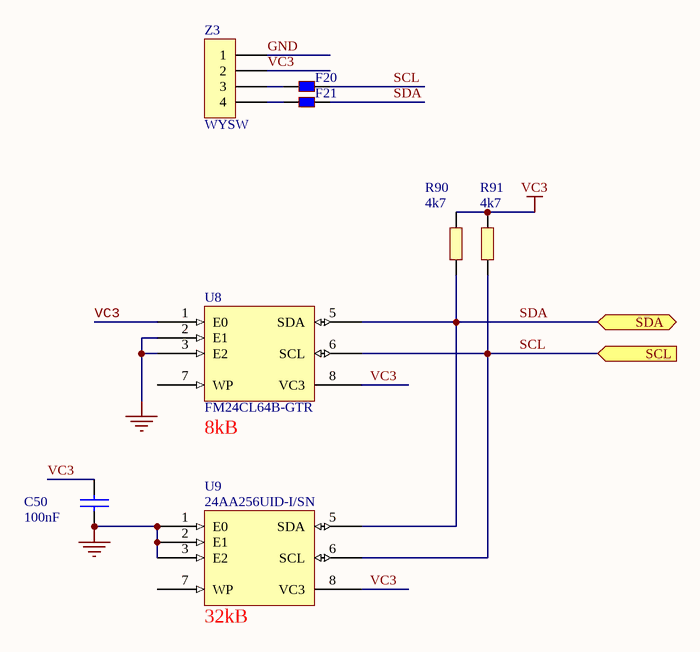
[diagram p5: i2c.SchDoc]

### Parts
C50  100nF  [0603C]
F20  BLM18BB141SN1D  [0603R]  (value not drawn)
F21  BLM18BB141SN1D  [0603R]  (value not drawn)
R90  4k7  [0603R]
R91  4k7  [0603R]
U8  FM24CL64B-GTR  [SO8]
U9  24AA256UID-I/SN  [SO8]
Z3  WYSW  [SSD1306_PR]

### Ports
SCL (in), SDA (bidir)

### Nets
GND: C50.2 U8.2(E1) U8.3(E2) U8.4(GND) U9.1(E0) U9.2(E1) U9.3(E2) U9.4(GND) Z3.1
VC3: C50.1 R90.1 R91.1 U8.1(E0) U8.8(VC3) U9.8(VC3) Z3.2
SCL: F20.2 R91.2 U8.6(SCL) U9.6(SCL) ; port SCL
SDA: F21.2 R90.2 U8.5(SDA) U9.5(SDA) ; port SDA
NetF20_1: F20.1 Z3.3
NetF21_1: F21.1 Z3.4

Not connected (* = marked no-connect by the designer): U8 7(WP); U9 7(WP)

### Notes on the sheet
- (near U8) 8kB
- (near U9) 32kB

### Library data of the parts
C50 = CAP: Capacitor
F20 F21 = KORALIK: Koralik ferrytowy
R90 R91 = RES3
U8 U9 = AT24C02
Z3 = CON4: Connector

## Nets that join several sheets
AGND: Stabilizator (L6.2), InputAnalog (44 pins)
AVC3: Stabilizator (L5.2), InputAnalog (10 pins)
GND: ATRACK_KP_V1 (30 pins), Stabilizator (L4.2), Ethernet (18 pins), InputDig (41 pins), InputAnalog (U3.9), i2c (9 pins)
VC3: ATRACK_KP_V1 (24 pins), Stabilizator (L3.2), Ethernet (17 pins), InputDig (8 pins), i2c (7 pins)
VX: ATRACK_KP_V1 (B1.CB), Stabilizator (D1.A), InputDig (8 pins), InputAnalog (9 pins)
/CS_AC: ATRACK_KP_V1 (U1.77), InputAnalog (U4.18)
BUSY: ATRACK_KP_V1 (U1.88), InputAnalog (U4.16)
DCLK: ATRACK_KP_V1 (U1.89), InputAnalog (U4.19)
DD0: ATRACK_KP_V1 (U1.15), InputDig (C41.1 F19.1 R81.1)
DD1: ATRACK_KP_V1 (U1.23), InputDig (C40.1 F18.1 R77.1)
DD2: ATRACK_KP_V1 (U1.26), InputDig (C39.1 F17.1 R73.1)
DD3: ATRACK_KP_V1 (U1.29), InputDig (C38.1 F16.1 R69.1)
DD4: ATRACK_KP_V1 (U1.30), InputDig (C37.1 F15.1 R65.1)
DD5: ATRACK_KP_V1 (U1.31), InputDig (C36.1 F14.1 R61.1)
DD6: ATRACK_KP_V1 (U1.35), InputDig (C35.1 F13.1 R57.1)
DD7: ATRACK_KP_V1 (U1.36), InputDig (C34.1 F12.1 R53.1)
DIN: ATRACK_KP_V1 (U1.90), InputAnalog (U4.17)
DL0: ATRACK_KP_V1 (U1.47), InputDig (DL1.A)
DL1: ATRACK_KP_V1 (U1.46), InputDig (DL2.A)
DL2: ATRACK_KP_V1 (U1.40), InputDig (DL3.A)
DL3: ATRACK_KP_V1 (U1.41), InputDig (DL4.A)
DL4: ATRACK_KP_V1 (U1.42), InputDig (DL5.A)
DL5: ATRACK_KP_V1 (U1.43), InputDig (DL6.A)
DL6: ATRACK_KP_V1 (U1.44), InputDig (DL7.A)
DL7: ATRACK_KP_V1 (U1.45), InputDig (DL8.A)
DOUT: ATRACK_KP_V1 (U1.91), InputAnalog (U4.15)
E_CRS_DV: ATRACK_KP_V1 (U1.32), Ethernet (R26.1)
E_MDC: ATRACK_KP_V1 (U1.16), Ethernet (U2.13)
E_MDIO: ATRACK_KP_V1 (U1.25), Ethernet (R16.1 U2.12)
E_OSC: ATRACK_KP_V1 (U1.67), Ethernet (R29.1)
E_REF_CLK: ATRACK_KP_V1 (U1.24), Ethernet (R19.1 U2.14)
E_RST: ATRACK_KP_V1 (U1.17), Ethernet (U2.15)
E_RXD0: ATRACK_KP_V1 (U1.33), Ethernet (R23.1)
E_RXD1: ATRACK_KP_V1 (U1.34), Ethernet (R24.1)
E_TX_EN: ATRACK_KP_V1 (U1.48), Ethernet (U2.16)
E_TXD0: ATRACK_KP_V1 (U1.51), Ethernet (U2.17)
E_TXD1: ATRACK_KP_V1 (U1.52), Ethernet (U2.18)
GND_Z: ATRACK_KP_V1 (B1.CG1 B1.CG2 B1.CG3 R13.2), Stabilizator (17 pins)
PL1: ATRACK_KP_V1 (U1.86), InputAnalog (U3.8)
PL2: ATRACK_KP_V1 (U1.85), InputAnalog (U3.7)
PL3: ATRACK_KP_V1 (U1.84), InputAnalog (U3.6)
PL4: ATRACK_KP_V1 (U1.83), InputAnalog (U3.5)
PL5: ATRACK_KP_V1 (U1.82), InputAnalog (U3.4)
PL6: ATRACK_KP_V1 (U1.81), InputAnalog (U3.3)
PL7: ATRACK_KP_V1 (U1.80), InputAnalog (U3.2)
PL8: ATRACK_KP_V1 (U1.79), InputAnalog (U3.1)
SCL: ATRACK_KP_V1 (U1.92), i2c (F20.2 R91.2 U8.6 U9.6)
SDA: ATRACK_KP_V1 (U1.93), i2c (F21.2 R90.2 U8.5 U9.5)
SHDN: ATRACK_KP_V1 (U1.87), InputAnalog (U4.10)